# Altium schematic sheet 06-Lightsensor.SchDoc
size A
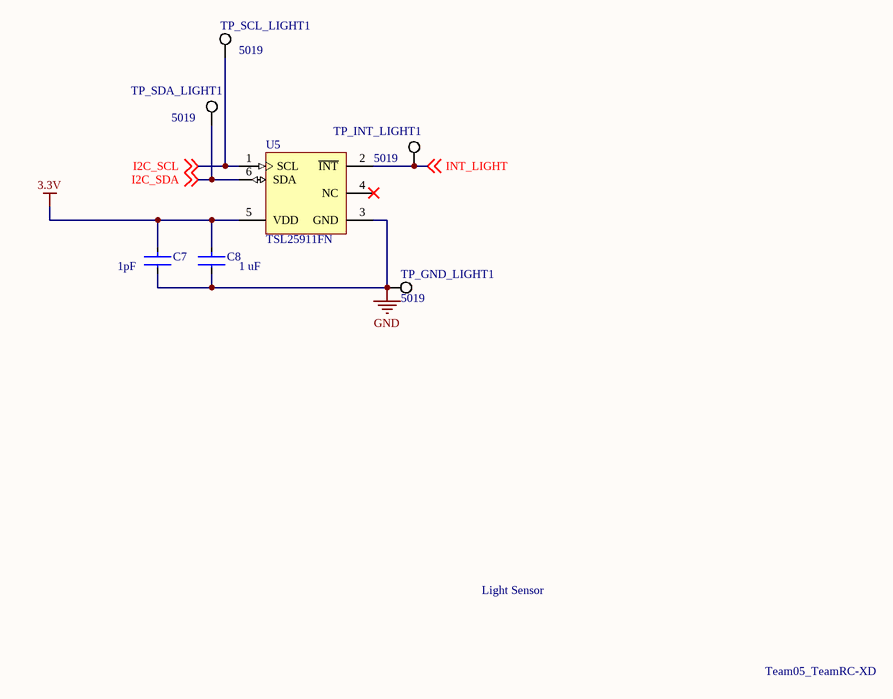
[diagram p0: 06-Lightsensor.SchDoc]

## Parts
C7  Capacitance: 1pF  [FP-CC0805-0_1-0_7-IPC_B]  (hidden comment: CC0805BRNPO9BN1R0)
C8  value 1 uF  [FP-CC0805-0_85-MFG]  (hidden comment: CC0805KKX7R6BB105)
TP_GND_LIGHT1  5019  [KSTN-5019_V]
TP_INT_LIGHT1  5019  [KSTN-5019_V]
TP_SCL_LIGHT1  5019  [KSTN-5019_V]
TP_SDA_LIGHT1  5019  [KSTN-5019_V]
U5  TSL25911FN  [AMS-FN-6-2400X2000DE_V]

## Nets
3.3V: C7.1 C8.1 U5.5(VDD)
GND: C7.2 C8.2 TP_GND_LIGHT1.1 U5.3(GND)
I2C_SCL: TP_SCL_LIGHT1.1 U5.1(SCL) ; off-sheet I2C_SCL
I2C_SDA: TP_SDA_LIGHT1.1 U5.6(SDA) ; off-sheet I2C_SDA
INT_LIGHT: TP_INT_LIGHT1.1 U5.2(~{INT}) ; off-sheet INT_LIGHT

Not connected (* = marked no-connect by the designer): U5 4(NC)*

## Notes on the sheet
- Light Sensor
- Team05_TeamRC-XD

## Library data of the parts
C7 = CMP-03422-001522-1: CAP CER 1PF 50V C0G/NPO 0805; Manufacturer: Yageo; Dielectric: C0G; Case Code (Imperial): 0805; Max Operating Temperature: 125°C; Packaging: Tape and Reel; Min Operating Temperature: -55°C; Weight: 0.000194oz; Resistor Type: Ceramic; Voltage Rating: 50V; Thickness: 0.028inch; Width: 0.049inch; Termination: SMD/SMT; RoHS Compliant: Yes; Length: 0.079inch; Voltage Rating (DC): 50V; Mount: Surface Mount; Height: 0.6mm; Case/Package: 0805; Series: CC; Case Code (Metric): 2012; Depth: 1.25mm; Supplier 1: Digi-Key; Supplier Part Number 1: 311-4124-6-ND; Manufacturer Part Number: CC0805BRNPO9BN1R0; RoHS: Yes; Category: Ceramic Capacitors; Stock 1: 21580; Pricing 1: 1=0.15000, 10=0.10900, 50=0.06180, 100=0.05120, 500=0.03592, 1000=0.02974 (USD); ComponentLink1URL: http://www.mouser.com/ds/2/447/Yageo_UPY-GP_NP0_16V-to-50V_9-358835.pdf?src-supplier=Mouser; ComponentLink1Description: http://www.mouser.com/ds/2/447/Yageo_UPY-GP_NP0_16V-to-50V_9-358835.pdf?src-supplier=Mouser; ComponentLink2URL: https://www.yageo.com/upload/media/product/productsearch/datasheet/mlcc/UPY-GP_NP0_16V-to-50V_18.pdf?src-supplier=Digi-Key; ComponentLink2Description: https://www.yageo.com/upload/media/product/productsearch/datasheet/mlcc/UPY-GP_NP0_16V-to-50V_18.pdf?src-supplier=Digi-Key; ComponentLink3URL: http://www.yageo.com/documents/recent/UPY-GP_NP0_16V-to-50V_16.pdf?src-supplier=Digi-Key; ComponentLink3Description: http://www.yageo.com/documents/recent/UPY-GP_NP0_16V-to-50V_16.pdf?src-supplier=Digi-Key; ComponentLink4URL: http://www.yageo.com/documents/recent/UPY-GP_NP0_16V-to-50V_8.pdf?src-supplier=Avnet; ComponentLink4Description: http://www.yageo.com/documents/recent/UPY-GP_NP0_16V-to-50V_8.pdf?src-supplier=Avnet; ComponentLink5URL: http://www.yageo.com/exep/pages/download/literatures/ProductSelectionGuide%202014_Final_2.pdf?src-supplier=Digi-Key; ComponentLink5Description: http://www.yageo.com/exep/pages/download/literatures/ProductSelectionGuide%202014_Final_2.pdf?src-supplier=Digi-Key
C8 = CMP-03422-000182-1: CAP CER 1UF 10V X7R 0805; Manufacturer: Yageo; Material: Ceramic; Tolerance: 0.1; ComponentLink2URL: http://www.yageo.com/documents/recent/UPY-GPHC_Y5V_6.3V-to-50V_8.pdf; Automotive: No; Temperature Range Low: -30°C; Octopart: https://octopart.com/cc0805kkx7r6bb105-yageo-42522859; Temperature Characteristic: X7R; RoHS: TRUE; Voltage Rating: 10 V; Capacitance: 1 uF; Package: CC0805-0.85; Device Class L3: Ceramic Capacitors; Category: Cap; Mouser Description: Multilayer Ceramic Capacitors MLCC - SMD/SMT 1.0uF 10V X7R 10%; Temperature Range High: +85°C; Ipc Land Pattern Name: CAPC200125X85; Manufacturer Part Number: CC0805KKX7R6BB105; ComponentLink2Description: Datasheet; Temperature: -30°C to +85°C; Height: 0.95mm; Lead Free: Yes; Device Class L1: Passive Components; Device Class L2: Capacitors; Footprint Url: http://www.yageo.com/exep/pages/download/literatures/UPY-C_GEN_24.pdf; Digikey Description: CAP CER 1UF 10V X7R 0805; Supplier 1: Digi-Key; Supplier Part Number 1: 311-1458-2-ND; Stock 1: 126000; Pricing 1: 3000=0.02620, 6000=0.02397, 9000=0.02230, 15000=0.02119, 30000=0.02007, 75000=0.01840 (USD); Mount: Surface Mount; Case/Package: 0805; Number of Pins: 2; Case Code (Imperial): 0805; Case Code (Metric): 2012; Dielectric Material: Ceramic; Min Operating Temperature: -55°C; Max Operating Temperature: 125°C; Dielectric: X7R; Voltage Rating (DC): 10V; Packaging: Tape and Reel; Package Quantity: 1; Termination: SMD/SMT; Resistor Type: Ceramic; Series: CC; Length: 2mm; Width: 1.25mm; Thickness: 0.057inch; Depth: 1.25mm; Radiation Hardening: No; REACH SVHC: Unknown; Halogen Free: Halogen Free; RoHS Compliant: Yes; ComponentLink1URL: https://datasheet.ciiva.com/7978/1489800-7978199.pdf?src-supplier=Element14; ComponentLink1Description: https://datasheet.ciiva.com/7978/1489800-7978199.pdf?src-supplier=Element14; ComponentLink3URL: https://datasheet.ciiva.com/28450/1489800-28450742.pdf?src-supplier=Element14; ComponentLink3Description: https://datasheet.ciiva.com/28450/1489800-28450742.pdf?src-supplier=Element14; ComponentLink4URL: https://datasheet.ciiva.com/46430/1734573-46430165.pdf?src-supplier=Element14; ComponentLink4Description: https://datasheet.ciiva.com/46430/1734573-46430165.pdf?src-supplier=Element14; ComponentLink5URL: https://datasheet.ciiva.com/176/mlccorderingcode-176908.pdf?src-supplier=Digi-Key; ComponentLink5Description: https://datasheet.ciiva.com/176/mlccorderingcode-176908.pdf?src-supplier=Digi-Key; ComponentLink6URL: https://datasheet.ciiva.com/176/mlccorderingcode-176907.pdf?src-supplier=Digi-Key; ComponentLink6Description: https://datasheet.ciiva.com/176/mlccorderingcode-176907.pdf?src-supplier=Digi-Key; ComponentLink7URL: https://datasheet.ciiva.com/176/mlccorderingcode-176909.pdf?src-supplier=Digi-Key; ComponentLink7Description: https://datasheet.ciiva.com/176/mlccorderingcode-176909.pdf?src-supplier=Digi-Key; ComponentLink8URL: https://datasheet.ciiva.com/8033/1489800-8033973.pdf?src-supplier=Element14; ComponentLink8Description: https://datasheet.ciiva.com/8033/1489800-8033973.pdf?src-supplier=Element14; ComponentLink9URL: https://datasheet.ciiva.com/8033/1489800-8033998.pdf?src-supplier=Element14; ComponentLink9Description: https://datasheet.ciiva.com/8033/1489800-8033998.pdf?src-supplier=Element14; ComponentLink10URL: https://datasheet.ciiva.com/13389/upy-gp-np0-16v-to-50v-8-13389349.pdf?src-supplier=Mouser; ComponentLink10Description: https://datasheet.ciiva.com/13389/upy-gp-np0-16v-to-50v-8-13389349.pdf?src-supplier=Mouser; ComponentLink11URL: https://datasheet.ciiva.com/11583/upy-gphc-x7r-6-3v-to-50v-8-11583596.pdf?src-supplier=Avnet; ComponentLink11Description: https://datasheet.ciiva.com/11583/upy-gphc-x7r-6-3v-to-50v-8-11583596.pdf?src-supplier=Avnet
TP_GND_LIGHT1 TP_INT_LIGHT1 TP_SCL_LIGHT1 TP_SDA_LIGHT1 = CMP-1672-00008-1: Test Point, 1 Position SMD, RoHS, Tape and Reel; Manufacturer: Keystone Electronics; ComponentLink1Description: Manufacturer URL; Package Quantity: 1000; DatasheetVersion: 03/2014; Packaging: Tape and Reel; ComponentLink2URL: http://www.keyelco.com/product-pdf.cfm?p=1357; ComponentLink1URL: http://www.keyelco.com/; Mount: Surface Mount; Contact Plating: Silver; PackageDescription: 1-Pin Surface Mount Device, Body 3.81 x 2.03 mm; Pins: 1; RoHSCompliant: True; Mounting Technology: Surface Mount; ComponentLink2Description: Datasheet; PackageReference: 5019; Supplier 1: Digi-Key; Supplier Part Number 1: 36-5019CT-ND; Manufacturer Part Number: 5019; RoHS: Yes; Category: Connectors; Stock 1: 1293364; Pricing 1: 1=0.34000, 25=0.27360, 100=0.22340, 250=0.20064, 500=0.19152 (USD); Number of Pins: 1; Material: Bronze; Contact Material: Bronze; Termination: SMD/SMT; Series: 5019; Height: 0.09inch; REACH SVHC: No SVHC; RoHS Compliant: Yes; Lead Free: Lead Free; ComponentLink3URL: https://datasheet.ciiva.com/16318/m60-2p61-16318395.pdf?src-supplier=Future+Electronics; ComponentLink3Description: https://datasheet.ciiva.com/16318/m60-2p61-16318395.pdf?src-supplier=Future+Electronics; ComponentLink4URL: https://datasheet.ciiva.com/16885/70182998-16885945.pdf?src-supplier=Allied+Electronics; ComponentLink4Description: https://datasheet.ciiva.com/16885/70182998-16885945.pdf?src-supplier=Allied+Electronics; ComponentLink5URL: https://datasheet.ciiva.com/14848/m60-2p61-14848437.pdf?src-supplier=Digi-Key; ComponentLink5Description: https://datasheet.ciiva.com/14848/m60-2p61-14848437.pdf?src-supplier=Digi-Key; ComponentLink6URL: https://datasheet.ciiva.com/14848/m60-2p61-14848438.pdf?src-supplier=Digi-Key; ComponentLink6Description: https://datasheet.ciiva.com/14848/m60-2p61-14848438.pdf?src-supplier=Digi-Key; ComponentLink7URL: https://datasheet.ciiva.com/14848/m60-2p61-14848439.pdf?src-supplier=Digi-Key; ComponentLink7Description: https://datasheet.ciiva.com/14848/m60-2p61-14848439.pdf?src-supplier=Digi-Key
U5 = CMP-0865-00001-1: Light-to-Digital Converter with I2C Interface, 2.7 to 3.6 V, -30 to 70 degC, FN-6, Pb-Free, Reel; Manufacturer: AMS; Interface: I2C - Vdd; Supply Voltage (V): 2.7 - 3.6; Maximum Lux: 88K; Programmable: Gain, Integration Time, Interrupt; Wavelength: 850nm; Data Bus Width: 16b; Max Frequency: 400kHz; Operating Supply Voltage: 3V; ComponentLink2Description: Datasheet; ComponentLink1URL: www.ams.com; Mounting Technology: Surface Mount; PackageReference: FN-6; PackageVersion: TAOS059Q, 11/2009; ComponentLink2URL: http://www.ams.com/eng/content/download/389383/1251117/221235; PartNumber: TSL25911FN; PackageDescription: 6-Pin Dual Flat No-Lead, 2.4 x 2 mm Body, 0.65 mm Pitch; ComponentLink1Description: Manufacturer URL; Supplier 1: Avnet; Supplier Part Number 1: 300150004; Manufacturer Part Number: TSL25911FN; RoHS: Yes; Category: Optical Sensors; Stock 1: 3500; Pricing 1: 3500=1.00640, 7000=0.97920, 14000=0.95200, 21000=0.92480, 28000=0.89760, 35000=0.87040, 350000=0.84320 (USD); Case/Package: WFDFN; Number of Pins: 6; Min Operating Temperature: -30°C; Max Operating Temperature: 70°C; Packaging: Tape and Reel; Package Quantity: 1; Output Type: I2C; Lead Free: Lead Free; RoHS Compliant: Yes; ComponentLink3URL: https://datasheet.ciiva.com/18495/tsl25911-datasheet-en-v1-18495162.pdf?src-supplier=Digi-Key; ComponentLink3Description: https://datasheet.ciiva.com/18495/tsl25911-datasheet-en-v1-18495162.pdf?src-supplier=Digi-Key; ComponentLink4URL: https://datasheet.ciiva.com/26985/tsl2591-v163-5-253098-26985860.pdf?src-supplier=Mouser; ComponentLink4Description: https://datasheet.ciiva.com/26985/tsl2591-v163-5-253098-26985860.pdf?src-supplier=Mouser; ComponentLink5URL: https://datasheet.ciiva.com/26993/tsl25911fn-26993335.pdf?src-supplier=Future+Electronics; ComponentLink5Description: https://datasheet.ciiva.com/26993/tsl25911fn-26993335.pdf?src-supplier=Future+Electronics; ComponentLink6URL: https://datasheet.ciiva.com/18495/tsl2591-datasheet-en-v2-18495163.pdf?src-supplier=Digi-Key; ComponentLink6Description: https://datasheet.ciiva.com/18495/tsl2591-datasheet-en-v2-18495163.pdf?src-supplier=Digi-Key; ComponentLink7URL: https://datasheet.ciiva.com/18495/tsl2591-datasheet-en-v2-18495164.pdf?src-supplier=Digi-Key; ComponentLink7Description: https://datasheet.ciiva.com/18495/tsl2591-datasheet-en-v2-18495164.pdf?src-supplier=Digi-Key